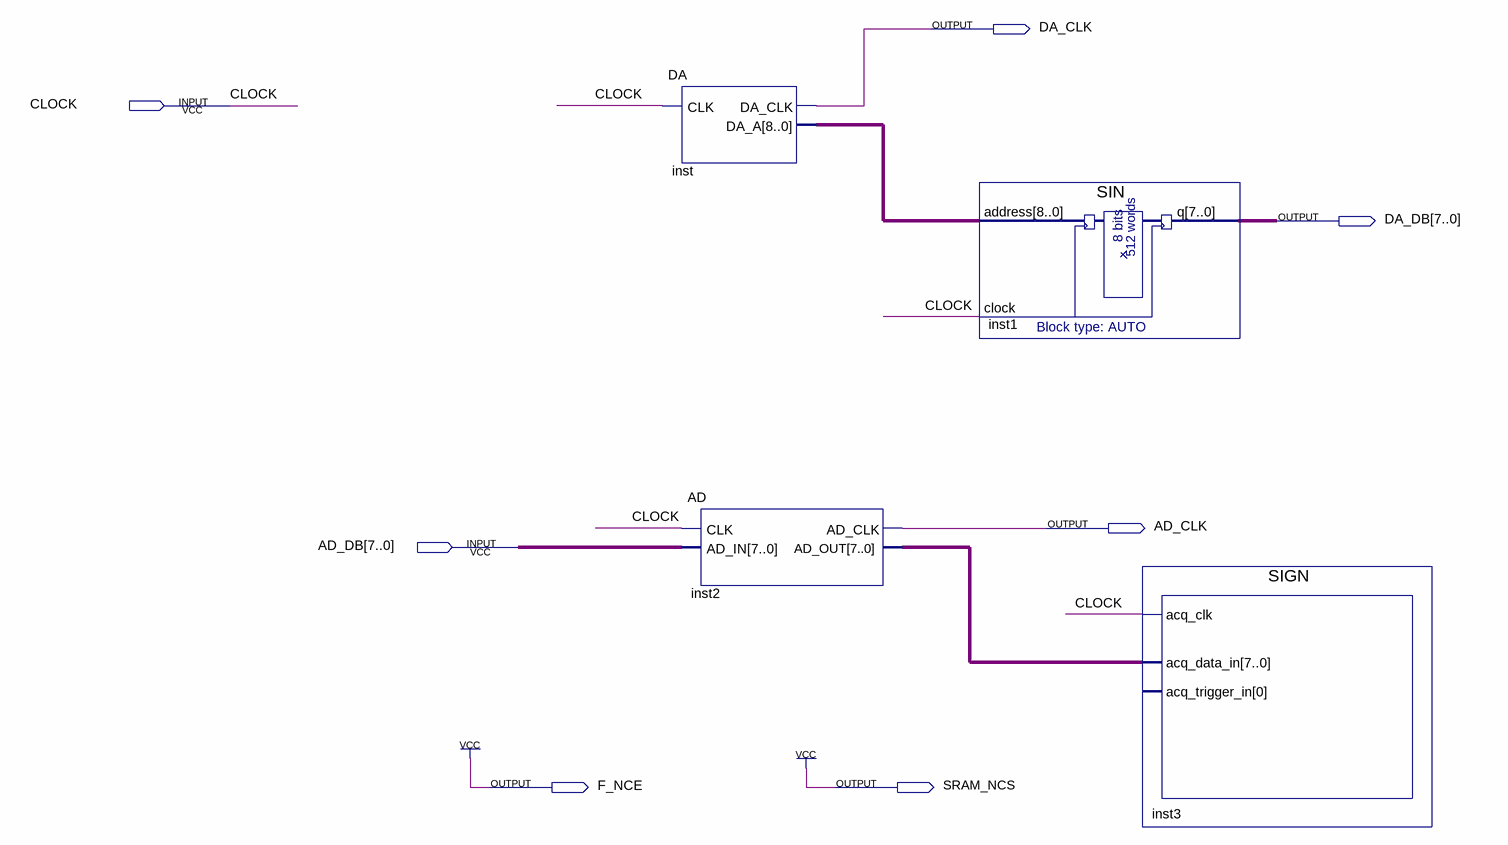
[diagram p0: schematic sheet]
// Quartus schematic ADDA.bdf as structural Verilog: 4 symbols, 7 pins
module ADDA (
  input  CLOCK,
  input  [7:0] AD_DB,
  output DA_CLK,
  output [7:0] DA_DB,
  output AD_CLK,
  output F_NCE,
  output SRAM_NCS
);

  wire [7:0] inst2_ad_out;
  wire [8:0] inst_da_a;

  DA inst (.CLK(CLOCK), .DA_CLK(DA_CLK), .DA_A(inst_da_a));
  AD inst2 (.CLK(CLOCK), .AD_IN(AD_DB), .AD_CLK(AD_CLK), .AD_OUT(inst2_ad_out));
  SIN inst1 (.address(inst_da_a), .clock(CLOCK), .q(DA_DB));
  SIGN inst3 (.acq_clk(CLOCK), .acq_data_in(inst2_ad_out));  // open: acq_trigger_in

  assign F_NCE = 1'b1;
  assign SRAM_NCS = 1'b1;
endmodule
